# EAGLE design Adafruit DS3231 STEMMA QT (EAGLE 9.6.2)
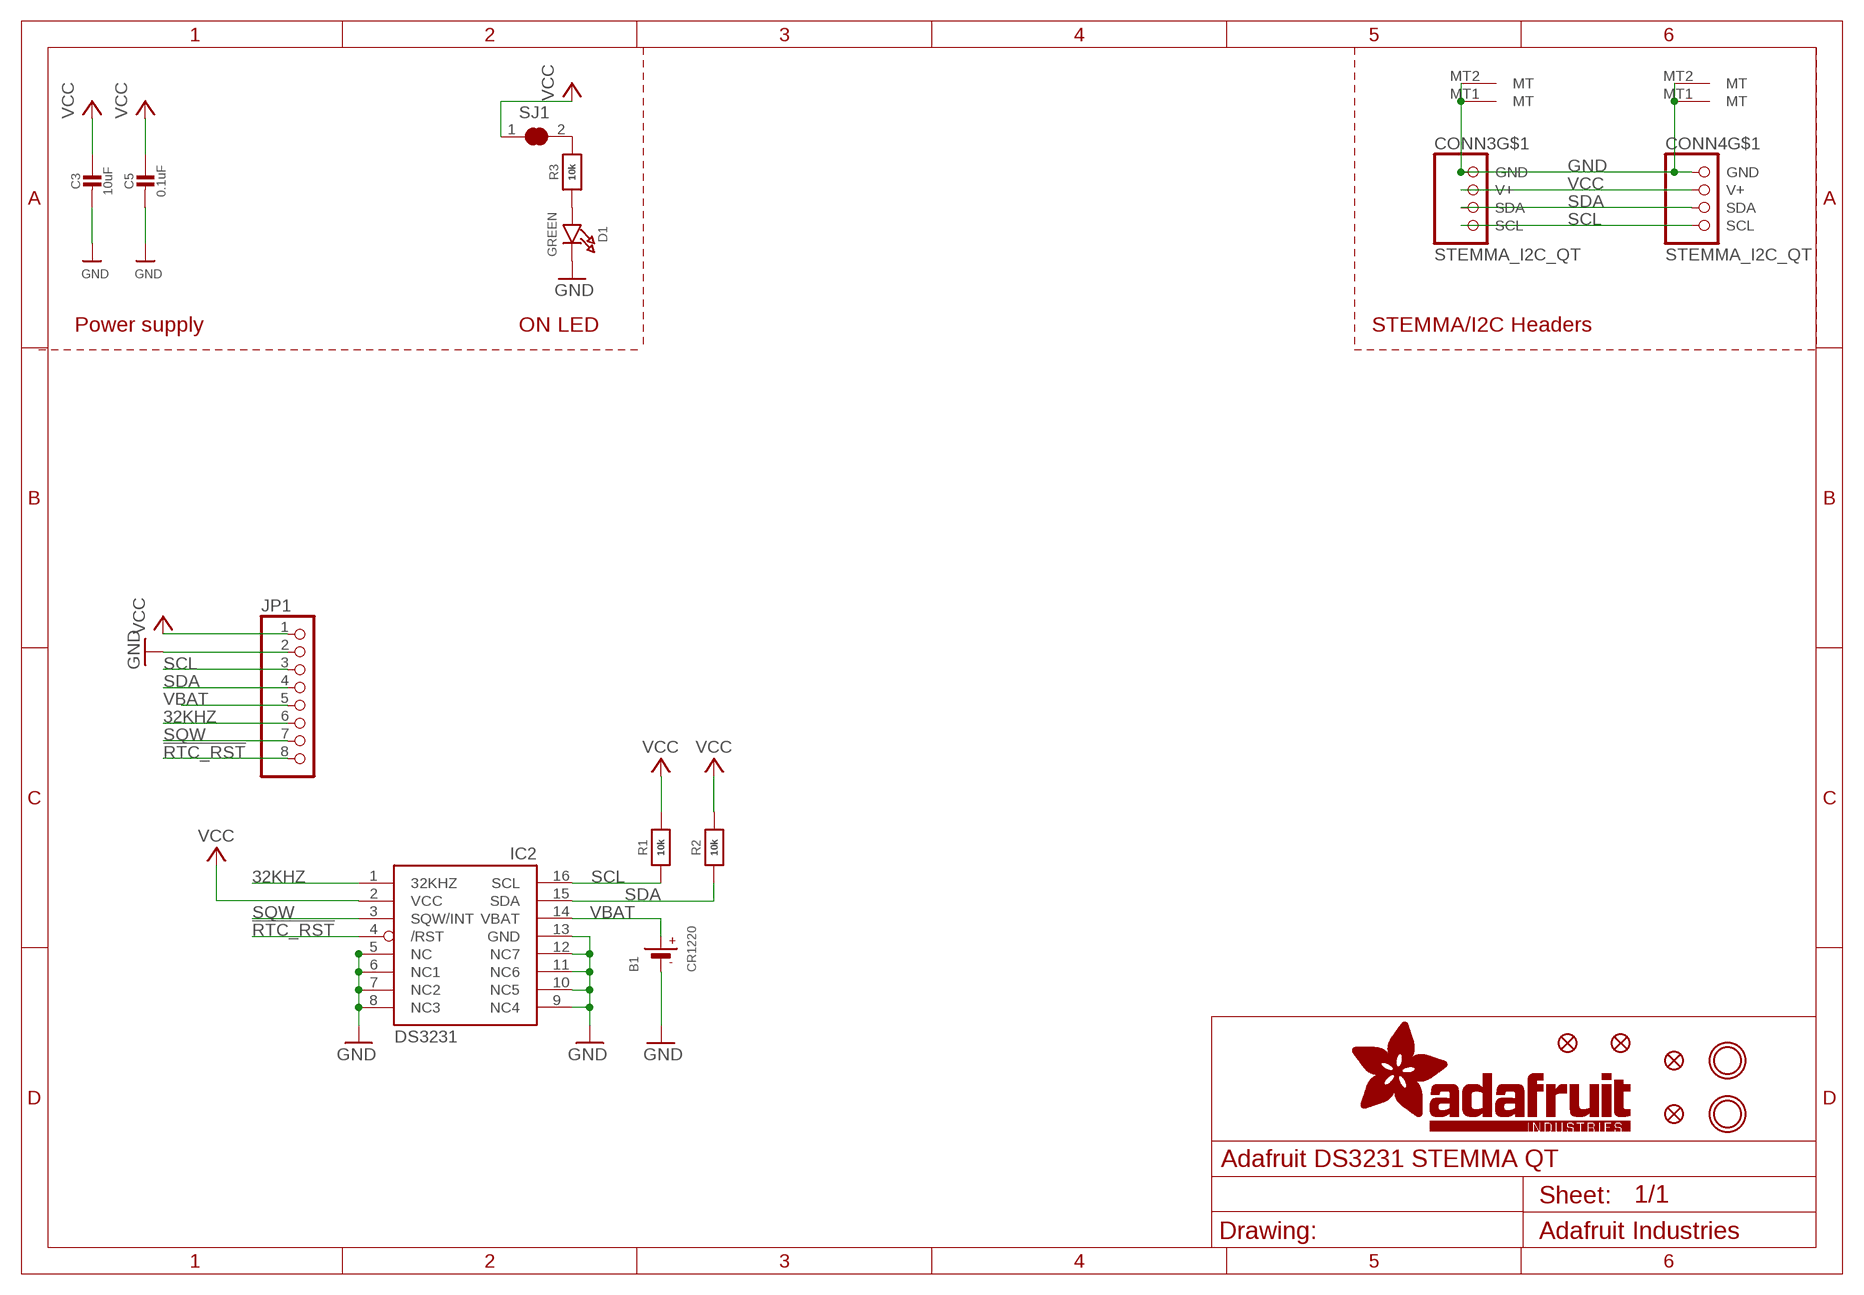
[diagram p0: schematic, sheet 1]

## Parts
B1  CR1220  BATTERYCR1220_SMT  [CR1220]
C3  10uF  CAP_CERAMIC0805-NOOUTLINE  [0805-NO]
C5  0.1uF  CAP_CERAMIC0603_NO  [0603-NO]
CONN3  STEMMA_I2C_QT  [JST_SH4]
CONN4  STEMMA_I2C_QT  [JST_SH4]
D1  GREEN  LED0603_NOOUTLINE  [CHIPLED_0603_NOOUTLINE]
FID1  FIDUCIAL_1MM  [FIDUCIAL_1MM]
FID2  FIDUCIAL_1MM  [FIDUCIAL_1MM]
FID3  FIDUCIAL_1MM  [FIDUCIAL_1MM]
FID4  FIDUCIAL_1MM  [FIDUCIAL_1MM]
IC2  DS3231/SO  [SO16W]
JP1  HEADER-1X870MIL  [1X08_ROUND_70]
R1  10k  RESISTOR_0603_NOOUT  [0603-NO]
R2  10k  RESISTOR_0603_NOOUT  [0603-NO]
R3  10k  RESISTOR_0603_NOOUT  [0603-NO]
SJ1  SOLDERJUMPER_CLOSED  [SOLDERJUMPER_CLOSEDWIRE]
U$9  MOUNTINGHOLE3.0THIN  [MOUNTINGHOLE_3.0_PLATEDTHIN]
U$17  MOUNTINGHOLE3.0THIN  [MOUNTINGHOLE_3.0_PLATEDTHIN]

## Nets
32KHZ: IC2.1(32KHZ) JP1.6
!RTC_RST: IC2.4(/RST) JP1.8
GND: B1.- C3.2 C5.2 CONN3.1(GND) CONN3.MT1(MT) CONN3.MT2(MT) CONN4.1(GND) CONN4.MT1(MT) CONN4.MT2(MT) D1.C IC2.5(NC) IC2.6(NC1) IC2.7(NC2) IC2.8(NC3) IC2.9(NC4) IC2.10(NC5) IC2.11(NC6) IC2.12(NC7) IC2.13(GND) JP1.2
N$1: R3.2 SJ1.2
N$4: D1.A R3.1
SCL: CONN3.4(SCL) CONN4.4(SCL) IC2.16(SCL) JP1.3 R1.1
SDA: CONN3.3(SDA) CONN4.3(SDA) IC2.15(SDA) JP1.4 R2.1
SQW: IC2.3(SQW/INT) JP1.7
VBAT: B1.+$1(+) B1.+$2(+) IC2.14(VBAT) JP1.5
VCC: C3.1 C5.1 CONN3.2(V+) CONN4.2(V+) IC2.2(VCC) JP1.1 R1.2 R2.2 SJ1.1

## Notes on the sheet
- Power supply | ON LED | STEMMA/I2C Headers

## Library data of the parts
B1 = microbuilder:BATTERY: CR1220 SMT - Digikey: 3001K-ND CD2032 BAT-HLD-001 - Digikey: BAT-HLD-001-ND
C3 C5 = microbuilder:CAP_CERAMIC: Ceramic Capacitors For new designs, use the packages preceded by an '_' character since they are more reliable: The following footprints should be used on most boards: _0402 - Standard footprint for regular board layouts _0603 - Standard footprint for regular board layouts _0805 - Standard footprint for regular board layouts _1206 - Standard footprint for regular board layouts For extremely tight-pitch boards where space is at a premium, the following 'micro-pitch' footprints can be used (smaller pads, no silkscreen outline, etc.): _0402MP - Micro-pitch footprint for very dense/compact boards _0603MP - Micro-pitch footprint for very dense/compact boards _0805MP - Micro-pitch footprint for very dense/compact boards _1206MP - Micro-pitch footprint for very dense/compact boards
CONN3 CONN4 = microbuilder:STEMMA_I2C
D1 = microbuilder:LED: LED 0603 - 0603 Surface Mount Package 2mA: Green LED - Low Power (3.9mcd, 2ma, 1.7Vf) - Digikey: 475-2709-2-ND Orange LED - Low Power (9.8mcd, 2ma, 1.8Vf) - Digikey: 475-1194-2-ND Red LED - Low Power (5mcd, 2ma, 1.8Vf) - Digikey: 475-1195-2-ND Yellow LED - Low Power (7mcd, 2ma, 1.8Vf) - Digikey: 475-1196-2-ND 5mA: Blue LED - Low Power (17mcd, 5ma, 2.9Vf) - Digikey: LNJ937W8CRACT-ND 0805 - 0805 Surface Mount Package 2mA: Red LED (8.8mcd, 2mA, 1.8Vf, Clear) - Low Power [Digikey: 475-2510-1-ND] Green LED (5mcd, 2mA, 1.8Vf, Clear) - Low Power [Digikey: 475-2730-1-ND] Yellow LED (11.3mcd, 2mA, 1.8Vf, Clear) - Low Power [Digikey: 475-2555-1-ND] 20mA: Red LED (104mcd, 20mA, Diffused) - LS R976 [Digikey: 475-1278-6-ND] Red LED (12mcd, 20mA, 2.0Vf, Clear) - APT2012EC [Digikey: 754-1128-1-ND] Green LED (15mcd, 20mA, 2.2Vf, Clear) - APT2012GC [Digikey: 754-1131-1-ND] Orange LED (160mcd, 20mA, 2.1Vf, Clear) - APT2012SECK [Digikey: 754-1130-1-ND] 1206 - 1206 Surface Mount Package Green LED (26mcd, 20mA, Diffused) - LG N971 [Digikey: 475-1407-6-ND] Red LED (15mcd, 20mA, Diffused) - LH N974 [Digikey: 475-1416-6-ND] Cree - Cree High-Power Surface Mount LEDs XPEBWT-L1-0000-00D50 - White 111lm 350mA 2.9Vf 6200K 110° XTEAWT-00-0000-00000LEE3 - White 114lm 350mA 2.85Vf 5000K 115° Everlight - Everlight 45-21 Series Surface Mount LEDs 45-21/QK2C-B2832AC2CB2/2T - Warm White 2000mcd 20mA 3.25Vf 3050K 120° 45-21/LK2C-B38452C4CB2/2T - Nuetral White 2000mcd 20mA 3.25Vf 4150K 120° 45-21/LK2C-B50634C6CB2/2T - Cold White 2200mcd 20mA 3.25Vf 5650K 120° PLCC2 Reverse Mount LS T77K-J1L2-1-0-2-R18-Z - Red 11.25mcd 2mA 1.8Vf 630nm 120° LO T77K-L1M2-24-Z - Orange 19.6mcd 2mA 1.8Vf 606nm 120° LY T77K-K2M1-26-Z - Yellow 15.7mcd 2mA 1.8Vf 587nm 120°
FID1-FID4 = microbuilder:FIDUCIAL: Fiducial Alignment Points Various fiducial points for machine vision alignment.; BOM: EXCLUDE
IC2 = adafruit_sensor:DS3231
JP1 = microbuilder:HEADER-1X8: PIN HEADER
R1-R3 = microbuilder:RESISTOR: Resistors For new designs, use the packages preceded by an '_' character since they are more reliable: The following footprints should be used on most boards: _0402 - Standard footprint for regular board layouts _0603 - Standard footprint for regular board layouts _0805 - Standard footprint for regular board layouts _1206 - Standard footprint for regular board layouts For extremely tight-pitch boards where space is at a premium, the following 'micro-pitch' footprints can be used (smaller pads, no silkscreen outline, etc.): _0402MP - Micro-pitch footprint for very dense/compact boards _0603MP - Micro-pitch footprint for very dense/compact boards _0805MP - Micro-pitch footprint for very dense/compact boards _1206MP - Micro-pitch footprint for very dense/compact boards
SJ1 = microbuilder:SOLDERJUMPER_CLOSED: Solder Jumper - Closed These solder jumpers are closed by default CLOSEDWIRE - 10 mil trace between pads that can be cut and resoldered later CLOSEDPERM - 63 mil trace between pads for a permanent connection (used to 'bridge' two signals, a shameless hack for Eagle). Can double as a test point as well (no cream layer)
U$9 U$17 = adafruit_electromech:MOUNTINGHOLE: Mounting Hole For #2 screws (0.086"/2.18mm width, 0.094"/2.4mm hole) use 2.5mm; BOM: EXCLUDE

## Net classes
1 highpower: width 0.305 mm, drill 0.483 mm
2 lowpower: width 0.254 mm, drill 0.483 mm

## Board
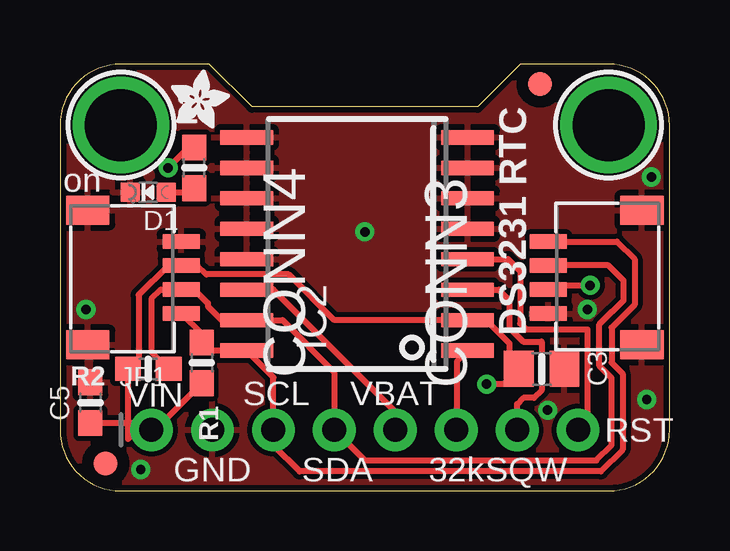
[diagram p1: board, top side]
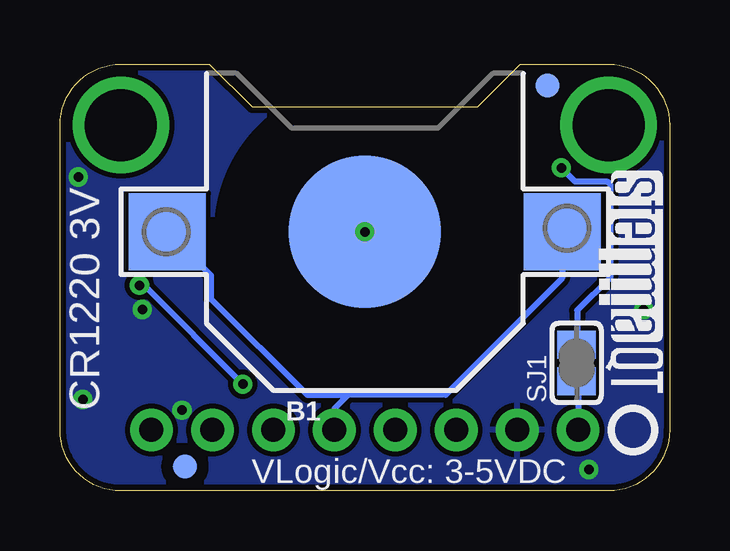
[diagram p2: board, bottom side, seen from below]

Size 25.4 x 17.78 mm. Coordinates in mm from the lower left corner, seen from the top.
Outline: 0,15.24 0,2.54 arc90 2.54,0 22.86,0 arc90 25.4,2.54 25.4,15.24 arc90 22.86,17.78 19.18,17.78 17.4,16 8,16 6.22,17.78 2.54,17.78 arc90 0,15.24
Copper layers (1*16): Top 0.035mm / dielectric 1.5mm / Bottom 0.035mm
Design rules "adafruit *": minimum track width 8mil, minimum drill 15.5mil, track to track 8mil, track to pad 8mil, pad to pad 8mil, via to via 8mil, smd to smd 8mil, copper to edge 10mil, drill to drill 8mil, minimum pad ring 10mil, minimum via ring 8mil, stop-mask expansion 2mil, vias tented up to drill 20mil, thermal gap 10mil

### Footprints (pad centres in the part's own frame; a part is rotated, then mirrored left to right if it is on the bottom)
CR1220 = smd 3.2 x 3.2: +$1 -8.225,0; +$2 8.225,0 | smd 6.35 x 6.35: - 0,0
0805-NO = smd 1.24 x 1.5: 1 -0.95,0; 2 0.95,0
0603-NO = smd 1.075 x 1: 1 -0.85,0; 2 0.85,0
JST_SH4 = smd 0.6 x 1.55: 1 -1.5,2.514; 2 -0.5,2.514; 3 0.5,2.514; 4 1.5,2.514 | smd 1.2 x 1.8: MT1 -2.8,-1.386; MT2 2.8,-1.386
CHIPLED_0603_NOOUTLINE = smd 0.8 x 0.8: A 0,-0.75; C 0,0.75
FIDUCIAL_1MM = smd 1 x 1: 1 0,0
SO16W = smd 0.6 x 2.2: 1 -4.445,-4.6; 2 -3.175,-4.6; 3 -1.905,-4.6; 4 -0.635,-4.6; 5 0.635,-4.6; 6 1.905,-4.6; 7 3.175,-4.6; 8 4.445,-4.6; 9 4.445,4.6; 10 3.175,4.6; 11 1.905,4.6; 12 0.635,4.6; 13 -0.635,4.6; 14 -1.905,4.6; 15 -3.175,4.6; 16 -4.445,4.6
1X08_ROUND_70 = drill 1 pad 1.778: 1 -8.89,0; 2 -6.35,0; 3 -3.81,0; 4 -1.27,0; 5 1.27,0; 6 3.81,0; 7 6.35,0; 8 8.89,0
SOLDERJUMPER_CLOSEDWIRE = smd 1.168 x 1.6: 1 -0.762,0; 2 0.762,0 | smd 0.635 x 0.203: WIRE 0,0
MOUNTINGHOLE_3.0_PLATEDTHIN = drill 3 pad 3.6: P$1 0,0

### Placement (x,y rotation side)
B1  12.7,10.79 0 bottom
C3  20.07,5.08 0 top
C5  1.27,3.68 90 top
CONN3  22.86,8.89 90 top
CONN4  2.54,8.89 270 top
D1  3.68,12.45 90 top
FID1  5.08,16.89 0 bottom
FID2  20.19,1.02 0 bottom
FID3  20,16.95 0 top
FID4  1.91,1.14 0 top
IC2  12.38,10.29 90 top
JP1  12.7,2.54 0 top
R1  5.91,5.33 270 top
R2  3.68,5.08 180 top
R3  5.59,13.46 90 top
SJ1  3.87,5.33 90 bottom
U$1  [ADAFRUIT_2.5MM]  4.64,15.11 0 top
U$9  2.54,15.24 0 top
U$17  22.86,15.24 0 top
U$25  [PCBFEAT-REV-040]  1.52,2.54 180 bottom
U$31  [STEMMAQT]  2.92,13.34 270 bottom

### Tracks (layer width: path | path; a pad name or v marks a point on that pad's centre or on a via)
32KHZ
  Top 0.254: IC2.1 16.54,5.4 16.54,2.57 JP1.6
!RTC_RST
  Top 0.254: IC2.4 18.67,9.65 19.18,9.14 19.18,6.99 19.43,6.73 21.96,6.73 21.97,6.72 21.97,2.92 JP1.8
GND  (via drill 0.39)
  other vias: 20.32,3.37 21.97,7.56 24.45,3.81 24.64,13.08 12.7,10.79 1.08,7.56 3.37,0.89
  pour Top: 0,17.78 25.4,17.78 25.4,0 0,0
  pour Bottom: 0,17.78 25.4,17.78 25.4,0 0,0
N$1  (via drill 0.39)
  Top 0.254: R3.2 5.36,14.31 v4.51,13.46
  Bottom 0.254: v4.51,13.46 3.95,12.9 2.6,12.9 2.48,12.78 2.48,8.89 3.85,7.52 3.85,6.12 SJ1.2
N$4
  Top 0.254: D1.A 5.42,12.45 R3.1
SCL
  Top 0.254: CONN4.4 5.91,6.54 R1.1 6.25,5.84 IC2.16 8.89,4.73 JP1.3 8.89,1.91 9.98,0.81 22.54,0.81 23.44,1.72 23.44,4.89 22.99,5.35 22.99,6.8 23.21,7.02 23.94,7.75 23.94,9.65 23.2,10.39 CONN3.4
SDA
  Top 0.254: CONN3.3 22.85,9.4 23.48,8.76 23.48,7.94 23.02,7.48 22.48,6.94 22.48,5.21 22.99,4.7 22.99,1.91 22.35,1.27 12.7,1.27 JP1.4 11.43,4.95 9.27,7.11 IC2.15 6.73,7.11 6.16,7.68 6.16,7.83 5.6,8.39 CONN4.3 4.2,8.39 3.81,8 3.81,5.8 R2.1
SQW
  Top 0.254: IC2.3 18.29,8.38 18.72,7.95 18.72,6.8 19.29,6.22 20.07,6.22 20.07,4.19 19.75,3.87 19.3,3.87 19.05,3.62 JP1.7
VBAT
  Top 0.254: IC2.14 8.89,8.38 13.97,3.3 JP1.5
  Bottom 0.254: B1.+$2 4.47,8.86 9.34,4 13.4,4 | 13.4,4 13.97,3.43 JP1.5 | B1.+$1 19.11,8.98 19.11,8.01 15.1,4 13.4,4
VCC  (via drill 0.39)
  Top 0.254: 3.68,2.54 JP1.1 4.23,2.54 4.23,2.81 R1.2 | 3.68,2.54 3.43,2.54 3.32,2.65 2.83,2.16 R2.2 3.28,5.52 3.28,8.17 4.5,9.39 CONN4.2 5.72,9.39 6.1,9.02 9.53,9.02 11.43,7.11 IC2.2 17.76,7.11 18.72,6.15 18.72,5.13 18.67,5.08 C3.1 18.48,4.45 v17.78,4.45 | C5.1 3.39,2.83 3.68,2.54 | CONN3.2 20.63,8.39 20.61,8.41 20.76,8.56 v22.09,8.56
  Bottom 0.254: v22.09,8.56 21.9,8.56 v17.78,4.45 | SJ1.1 3.81,4.51 JP1.1

### Text on the board
tPlace: on | DS3231 RTC | VIN | SCL | VBAT | RST | GND | SDA | 32k | SQW
bPlace: CR1220 3V | VLogic/Vcc: 3-5VDC